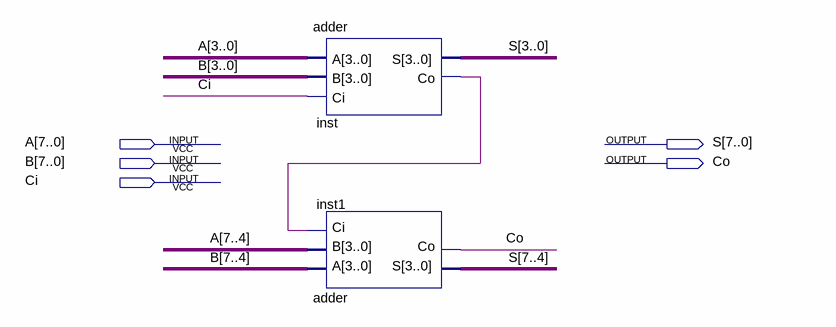
[diagram p0: schematic sheet]
// Quartus schematic add8.bdf as structural Verilog: 2 symbols, 5 pins
module add8 (
  input  [7:0] A,
  input  [7:0] B,
  input  Ci,
  output [7:0] S,
  output Co
);

  wire inst_co;

  adder inst (.A(A[3:0]), .B(B[3:0]), .Ci(Ci), .S(S[3:0]), .Co(inst_co));
  adder inst1 (.A(B[7:4]), .B(A[7:4]), .Ci(inst_co), .S(S[7:4]), .Co(Co));
endmodule
